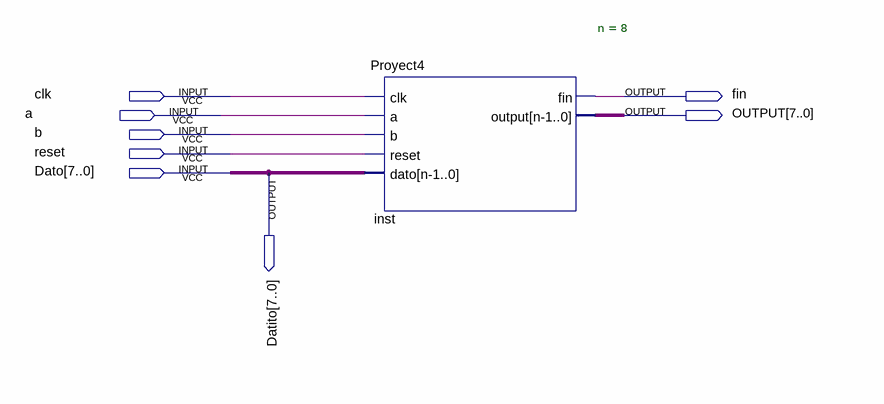
[diagram p0: schematic sheet]
// Quartus schematic Block1.bdf as structural Verilog: 1 symbols, 8 pins
module Block1 (
  input  clk,
  input  a,
  input  b,
  input  reset,
  input  [7:0] Dato,
  output fin,
  output [7:0] OUTPUT,
  output [7:0] Datito
);

  Proyect4 #(.n(8)) inst (.clk(clk), .a(a), .b(b), .reset(reset), .dato(Dato), .fin(fin), .\output (OUTPUT));

  assign Datito = Dato;
endmodule
